# Altium schematic sheet MCU.SchDoc: N64 Controller
size A4; Author: TheComet; Revision: 1.0.0; ProjectName: N64 Controller
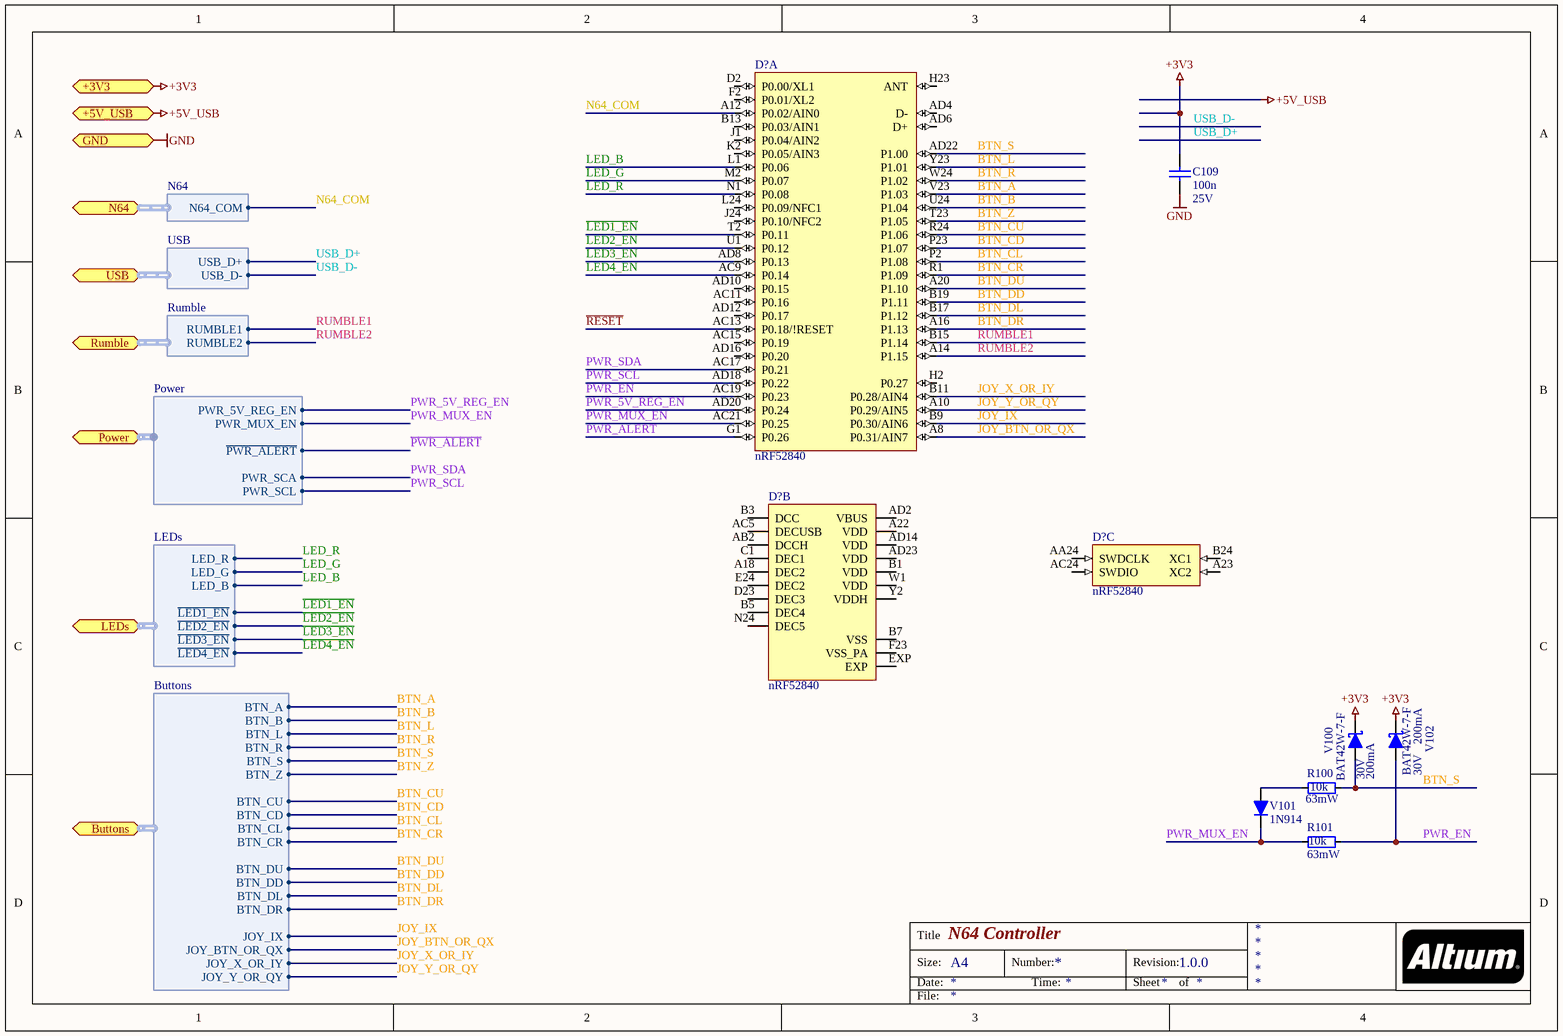
[diagram p0: MCU.SchDoc]

## Parts
(Parts that share a designator on the sheet are numbered #1, #2 ... from top to bottom, then left to right.)
C109  value 100n  Value2: 25V  [SMD_CAP_0402]  (hidden comment: C_SMD_CER_100N_25V_10%_X7R_0402)
D?#1  Type: nRF52840  [SMD_aQFN_73_nRF52840]  (hidden comment: D_NRF52840_aQFN-73)  (part A of 3)
D?#2  Type: nRF52840  [SMD_aQFN_73_nRF52840]  (hidden comment: D_NRF52840_aQFN-73)  (part B of 3)
D?#3  Type: nRF52840  [SMD_aQFN_73_nRF52840]  (hidden comment: D_NRF52840_aQFN-73)  (part C of 3)
R100  value 10k  Value2: 63mW  [SMD_RES_0402]  (hidden comment: R_SMD_THINFILM_10K_0W063_0%5_25PPM_0402)
R101  value 10k  Value2: 63mW  [SMD_RES_0402]  (hidden comment: R_SMD_THINFILM_10K_0W063_0%5_25PPM_0402)
V100  value 30V  Type: BAT42W-7-F  Value2: 200mA  [SMD_SOD_123]  (hidden comment: V_SMD_SCHOTTKY_BAT42W-7-F_30V_0A2_SOD-123)
V101  Type: 1N914  [SMD_SOD_323]  (hidden comment: V_SMD_DIODE_1N914_75V_0A15_SOD-323)
V102  value 30V  Type: BAT42W-7-F  Value2: 200mA  [SMD_SOD_123]  (hidden comment: V_SMD_SCHOTTKY_BAT42W-7-F_30V_0A2_SOD-123)

## Ports
+3V3, +5V_USB, Buttons (harness Buttons), GND, LEDs (harness LEDs), N64 (harness N64), Power (harness Power), Rumble (harness Rumble), USB (harness USB)

## Harnesses
LEDs: LED_R, LED_G, LED_B, ~{LED1_EN}, ~{LED2_EN}, ~{LED3_EN}, ~{LED4_EN}
Rumble: RUMBLE1, RUMBLE2
USB: USB_D-, USB_D+
N64: N64_COM
Buttons: BTN_A, BTN_B, BTN_CD, BTN_CL, BTN_CR, BTN_CU, BTN_DD, BTN_DL, BTN_DR, BTN_DU, BTN_L, BTN_R, BTN_S, BTN_Z, JOY_BTN_OR_QX, JOY_IX, JOY_X_OR_IY, JOY_Y_OR_QY
Power: ~{PWR_ALERT}, PWR_5V_REG_EN, PWR_MUX_EN, PWR_SCA, PWR_SCL

## Nets
+3V3: C109.2 V100.2 V102.2 ; port +3V3
+5V_USB: port +5V_USB
GND: C109.1 ; port GND
BTN_A: D?#1.V23(P1.03) ; port Buttons.BTN_A
BTN_B: D?#1.U24(P1.04) ; port Buttons.BTN_B
BTN_CD: D?#1.P23(P1.07) ; port Buttons.BTN_CD
BTN_CL: D?#1.P2(P1.08) ; port Buttons.BTN_CL
BTN_CR: D?#1.R1(P1.09) ; port Buttons.BTN_CR
BTN_CU: D?#1.R24(P1.06) ; port Buttons.BTN_CU
BTN_DD: D?#1.B19(P1.11) ; port Buttons.BTN_DD
BTN_DL: D?#1.B17(P1.12) ; port Buttons.BTN_DL
BTN_DR: D?#1.A16(P1.13) ; port Buttons.BTN_DR
BTN_DU: D?#1.A20(P1.10) ; port Buttons.BTN_DU
BTN_L: D?#1.Y23(P1.01) ; port Buttons.BTN_L
BTN_R: D?#1.W24(P1.02) ; port Buttons.BTN_R
BTN_S: D?#1.AD22(P1.00) R100.2 V100.1 ; port Buttons.BTN_S
BTN_Z: D?#1.T23(P1.05) ; port Buttons.BTN_Z
JOY_BTN_OR_QX: D?#1.A8(P0.31/AIN7) ; port Buttons.JOY_BTN_OR_QX
JOY_IX: D?#1.B9(P0.30/AIN6) ; port Buttons.JOY_IX
JOY_X_OR_IY: D?#1.B11(P0.28/AIN4) ; port Buttons.JOY_X_OR_IY
JOY_Y_OR_QY: D?#1.A10(P0.29/AIN5) ; port Buttons.JOY_Y_OR_QY
~{LED1_EN}: D?#1.T2(P0.11) ; port LEDs.~{LED1_EN}
~{LED2_EN}: D?#1.U1(P0.12) ; port LEDs.~{LED2_EN}
~{LED3_EN}: D?#1.AD8(P0.13) ; port LEDs.~{LED3_EN}
~{LED4_EN}: D?#1.AC9(P0.14) ; port LEDs.~{LED4_EN}
LED_B: D?#1.L1(P0.06) ; port LEDs.LED_B
LED_G: D?#1.M2(P0.07) ; port LEDs.LED_G
LED_R: D?#1.N1(P0.08) ; port LEDs.LED_R
N64_COM: D?#1.A12(P0.02/AIN0) ; port N64.N64_COM
~{PWR_ALERT}: D?#1.G1(P0.26) ; port Power.~{PWR_ALERT}
PWR_5V_REG_EN: D?#1.AD20(P0.24) ; port Power.PWR_5V_REG_EN
PWR_EN: D?#1.AC19(P0.23) R101.2 V102.1
PWR_MUX_EN: D?#1.AC21(P0.25) R101.1 V101.2 ; port Power.PWR_MUX_EN
PWR_SCL: D?#1.AD18(P0.22) ; port Power.PWR_SCL
PWR_SDA: D?#1.AC17(P0.21) ; port Power.PWR_SCA
~{RESET}: D?#1.AC13(P0.18/!RESET)
RUMBLE1: D?#1.B15(P1.14) ; port Rumble.RUMBLE1
RUMBLE2: D?#1.A14(P1.15) ; port Rumble.RUMBLE2
USB_D+: port USB.USB_D+
USB_D-: port USB.USB_D-
NetR100_1: R100.1 V101.1

Not connected (* = marked no-connect by the designer): D?#1 AC11(P0.16) AC15(P0.19) AD4(D-) AD6(D+) AD10(P0.15) AD12(P0.17) AD16(P0.20) B13(P0.03/AIN1) D2(P0.00/XL1) F2(P0.01/XL2) H2(P0.27) H23(ANT) J1(P0.04/AIN2) J24(P0.10/NFC2) K2(P0.05/AIN3) L24(P0.09/NFC1); D?#2 A18(DEC2) A22(VDD) AB2(DCCH) AC5(DECUSB) AD2(VBUS) AD14(VDD) AD23(VDD) B1(VDD) B3(DCC) B5(DEC4) B7(VSS) C1(DEC1) D23(DEC3) E24(DEC2) EXP F23(VSS_PA) N24(DEC5) W1(VDD) Y2(VDDH); D?#3 A23(XC2) AA24(SWDCLK) AC24(SWDIO) B24(XC1)

## Notes on the sheet
- Title
- Size:
- Date:
- A4
- Number:
- Time:
- Revision:
- Sheet
- of
- File:

## Library data of the parts
C109 = C_SMD_CER_100N_25V_10%_X7R_0402: 0.1µF ±10% 25V Ceramic Capacitor X7R 0402 (1005 Metric); Supplier - Digikey: 490-14603-1-ND
D?#1-D?#3 = D_NRF52840_aQFN-73: IC RF TxRx + MCU 802.15.4, Bluetooth Bluetooth v5.0 2.4GHz 73-VFQFN Dual Rows, Exposed Pad; Supplier - Digikey: 1490-1071-1-ND
R100 R101 = R_SMD_THINFILM_10K_0W063_0%5_25PPM_0402: SMD Resistor; Supplier - Digikey: P10KDECT-ND
V100 V102 = V_SMD_SCHOTTKY_BAT42W-7-F_30V_0A2_SOD-123: Diode Schottky 30V 200mA (DC) Surface Mount SOD-123; Supplier - Digikey: BAT42W-FDICT-ND
V101 = V_SMD_DIODE_1N914_75V_0A15_SOD-323: SMD Diode, 75V, 0.15A; Supplier - Digikey: 1N914BWSCT-ND